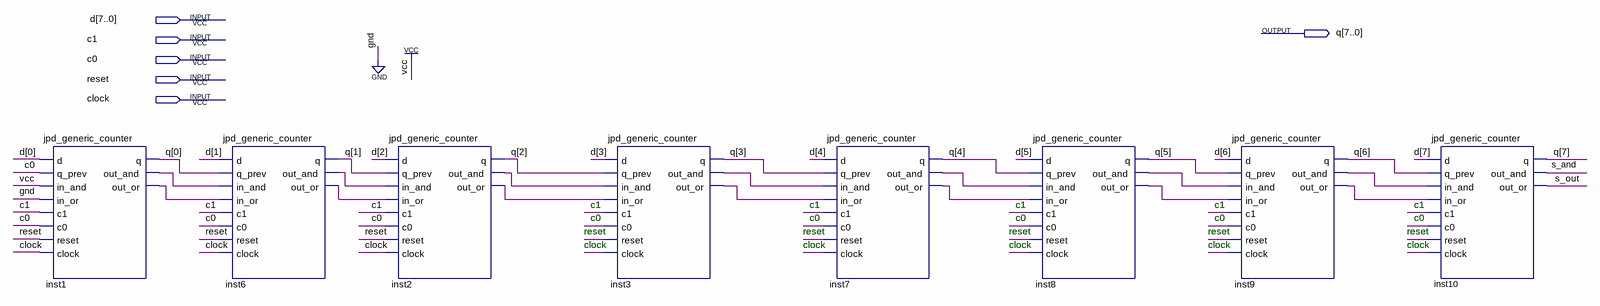
[diagram p0: schematic sheet]
// Quartus schematic jpd_counter_8.bdf as structural Verilog: 8 symbols, 6 pins
module jpd_counter_8 (
  input  [7:0] d,
  input  c1,
  input  c0,
  input  reset,
  input  clock,
  output [7:0] q
);

  wire inst1_out_and, inst1_out_or, inst2_out_and, inst2_out_or, inst3_out_and, inst3_out_or, inst6_out_and,
       inst6_out_or, inst7_out_and, inst7_out_or, inst8_out_and, inst8_out_or, inst9_out_and, inst9_out_or,
       s_and, s_out;

  jpd_generic_counter inst1 (
    .d(d[0]), .q_prev(c0), .in_and(1'b1), .in_or(1'b0), .c1(c1), .c0(c0), .reset(reset), .clock(clock),
    .q(q[0]), .out_and(inst1_out_and), .out_or(inst1_out_or));
  jpd_generic_counter inst6 (
    .d(d[1]), .q_prev(q[0]), .in_and(inst1_out_and), .in_or(inst1_out_or), .c1(c1), .c0(c0), .reset(reset),
    .clock(clock), .q(q[1]), .out_and(inst6_out_and), .out_or(inst6_out_or));
  jpd_generic_counter inst2 (
    .d(d[2]), .q_prev(q[1]), .in_and(inst6_out_and), .in_or(inst6_out_or), .c1(c1), .c0(c0), .reset(reset),
    .clock(clock), .q(q[2]), .out_and(inst2_out_and), .out_or(inst2_out_or));
  jpd_generic_counter inst3 (
    .d(d[3]), .q_prev(q[2]), .in_and(inst2_out_and), .in_or(inst2_out_or), .c1(c1), .c0(c0), .reset(reset),
    .clock(clock), .q(q[3]), .out_and(inst3_out_and), .out_or(inst3_out_or));
  jpd_generic_counter inst7 (
    .d(d[4]), .q_prev(q[3]), .in_and(inst3_out_and), .in_or(inst3_out_or), .c1(c1), .c0(c0), .reset(reset),
    .clock(clock), .q(q[4]), .out_and(inst7_out_and), .out_or(inst7_out_or));
  jpd_generic_counter inst8 (
    .d(d[5]), .q_prev(q[4]), .in_and(inst7_out_and), .in_or(inst7_out_or), .c1(c1), .c0(c0), .reset(reset),
    .clock(clock), .q(q[5]), .out_and(inst8_out_and), .out_or(inst8_out_or));
  jpd_generic_counter inst9 (
    .d(d[6]), .q_prev(q[5]), .in_and(inst8_out_and), .in_or(inst8_out_or), .c1(c1), .c0(c0), .reset(reset),
    .clock(clock), .q(q[6]), .out_and(inst9_out_and), .out_or(inst9_out_or));
  jpd_generic_counter inst10 (
    .d(d[7]), .q_prev(q[6]), .in_and(inst9_out_and), .in_or(inst9_out_or), .c1(c1), .c0(c0), .reset(reset),
    .clock(clock), .q(q[7]), .out_and(s_and), .out_or(s_out));

  // Notes on the sheet:
  //   c1
  //   c1
  //   c1
  //   c1
  //   c1
  //   c0
  //   c0
  //   c0
  //   c0
  //   c0
  //   reset
  //   reset
  //   reset
  //   reset
  //   reset
  //   clock
  //   clock
  //   clock
  //   clock
  //   clock
endmodule
